# EAGLE design guider-shield (EAGLE 7.6.0)
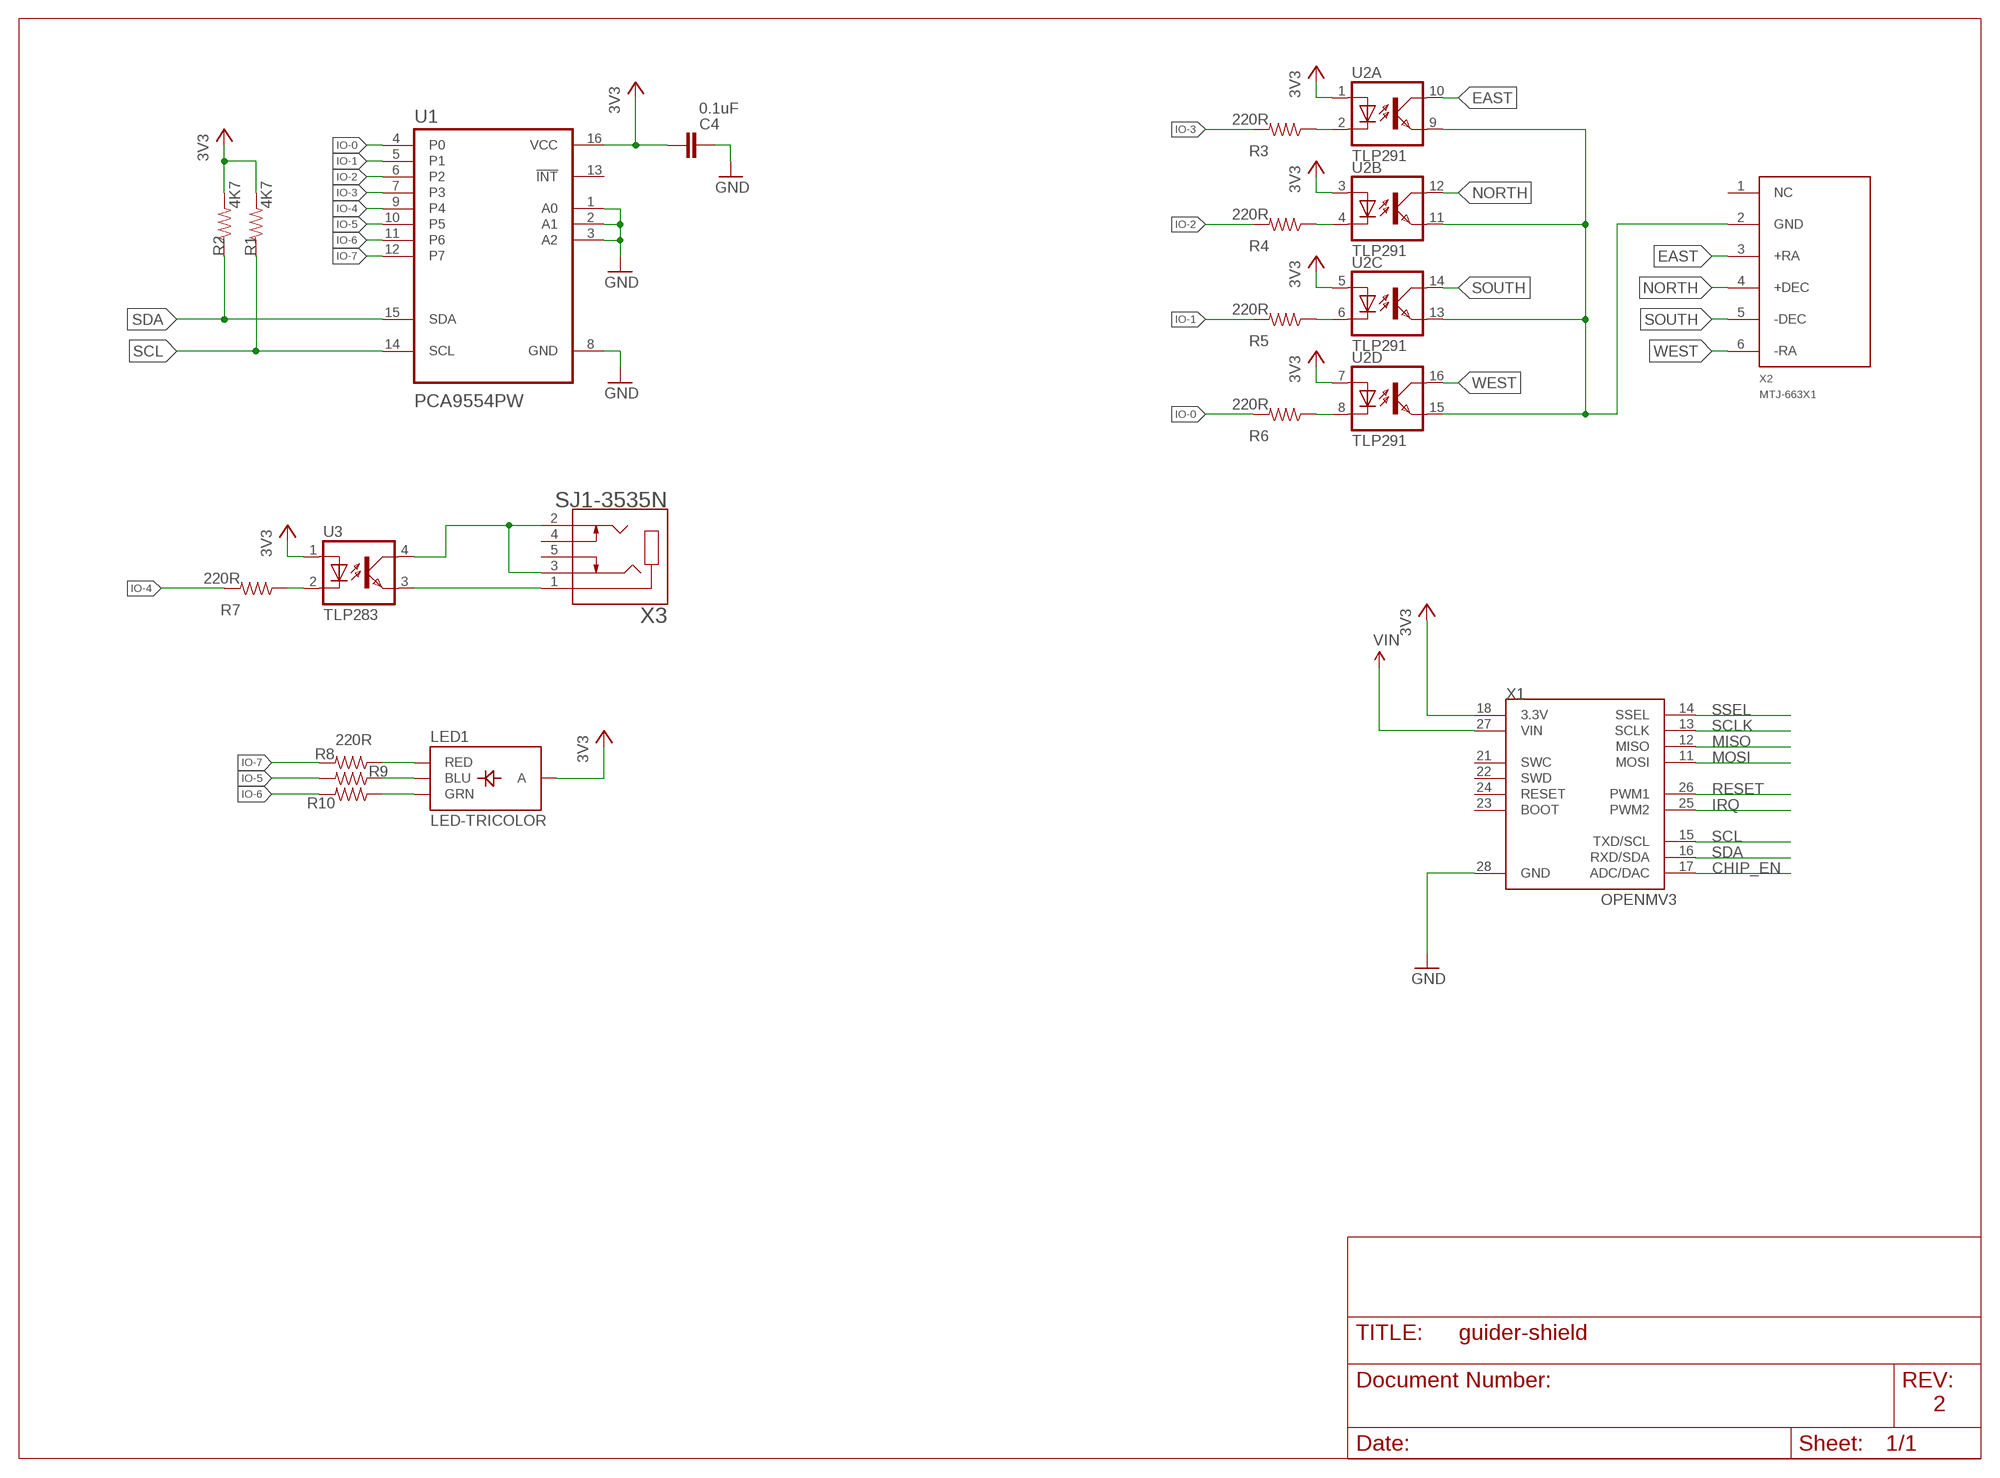
[diagram p0: schematic, sheet 1]

## Parts
C4  0.1uF  CAP0603-CAP  [0603-CAP]
LED1  LED-TRICOLOR  [LED-TRICOLOR-SMD]
R1  4K7  RESISTOR0603-RES  [0603-RES]
R2  4K7  RESISTOR0603-RES  [0603-RES]
R3  220R  RESISTOR0603-RES  [0603-RES]
R4  220R  RESISTOR0603-RES  [0603-RES]
R5  220R  RESISTOR0603-RES  [0603-RES]
R6  220R  RESISTOR0603-RES  [0603-RES]
R7  220R  RESISTOR0603-RES  [0603-RES]
R8  220R  RESISTOR0603-RES  [0603-RES]
R9  220R  RESISTOR0603-RES  [0603-RES]
R10  220R  RESISTOR0603-RES  [0603-RES]
U1  PCA9554PW  [SOP65P640X120-16N]
U2  TLP291  TLP283-4-SO016  [SO016]
U3  TLP283  [MINI-FLAT-4]
X1  OPENMV3  [OPENMV3]
X2  MTJ-663X1  ST-4-MTJ-663X1  [MTJ-663X1]
X3  SJ1-3535N  [CUI_SJ1-3535N]

## Nets
3V3: C4.1 LED1.A R1.2 R2.2 U1.16(VCC) U2.1(A:A) U2.3(B:A) U2.5(C:A) U2.7(D:A) U3.1(A) X1.18(3.3V)
CHIP_EN: X1.17(ADC/DAC)
EAST: U2.10(A:COL) X2.3(+RA)
GND: C4.2 U1.1(A0) U1.2(A1) U1.3(A2) U1.8(GND) X1.28(GND)
IO-0: R6.2 U1.4(P0)
IO-1: R5.2 U1.5(P1)
IO-2: R4.2 U1.6(P2)
IO-3: R3.2 U1.7(P3)
IO-4: R7.2 U1.9(P4)
IO-5: R9.2 U1.10(P5)
IO-6: R10.2 U1.11(P6)
IO-7: R8.2 U1.12(P7)
IRQ: X1.25(PWM2)
MISO: X1.12(MISO)
MOSI: X1.11(MOSI)
N$1: LED1.R(RED) R8.1
N$2: LED1.B(BLU) R9.1
N$4: LED1.G(GRN) R10.1
N$8: R3.1 U2.2(A:C)
N$13: R7.1 U3.2(C)
N$14: U3.3(EMIT) X3.1
N$15: U3.4(COL) X3.2 X3.3
N$16: R4.1 U2.4(B:C)
N$20: R5.1 U2.6(C:C)
N$21: R6.1 U2.8(D:C)
N$24: U2.9(A:EMIT) U2.11(B:EMIT) U2.13(C:EMIT) U2.15(D:EMIT) X2.2(GND)
NORTH: U2.12(B:COL) X2.4(+DEC)
RESET: X1.26(PWM1)
SCL: R1.1 U1.14(SCL) X1.15(TXD/SCL)
SCLK: X1.13(SCLK)
SDA: R2.1 U1.15(SDA) X1.16(RXD/SDA)
SOUTH: U2.14(C:COL) X2.5(-DEC)
SSEL: X1.14(SSEL)
VIN: X1.27(VIN)
WEST: U2.16(D:COL) X2.6(-RA)
Unconnected: U1.13(!INT) X1.21(SWC) X1.22(SWD) X1.23(BOOT) X1.24(RESET) X2.1(NC) X3.4 X3.5

## Notes on the sheet
- 2

## Library data of the parts
C4 = sfe:CAP: Capacitor Standard 0603 ceramic capacitor, and 0.1" leaded capacitor.
LED1 = guider-shield:LED-TRICOLOR: Tri-Color LED SMD Proven layout and schematic for triple color LED in SMD package - common anode. Spark Fun Electronics SKU : COM-07844; MFG-MODEL: CLV1A-FKB-CK1VW1DE1BB7C3C3
R1-R10 = sfe:RESISTOR: Resistor Basic schematic elements and footprints for 0603, 1206, and PTH resistors.
U1 = guider-shield:PCA9554PW; AVAILABILITY: Unavailable; DESCRIPTION: Remote 8-Bit I2C and SMBus I/O Expander with Interrupt Output and Configuration Registers 16-TSSOP -40 to 85; MF: Texas Instruments; MP: PCA9554PW; PACKAGE: TSSOP-16 Texas Instruments; PRICE: None
U2 = guider-shield:TLP283-4: TOSHIBA PHOTOCOUPLER GaAs IRED & PHOTO-TRANSISTOR Source: http://www.semicon.toshiba.co.jp/td/en/Opto/Photocoupler/en_20050928_TLP283_datasheet.pdf
U3 = guider-shield:TLP283: TOSHIBA PHOTOCOUPLER GaAs IRED & PHOTO-TRANSISTOR Source: http://www.semicon.toshiba.co.jp/td/en/Opto/Photocoupler/en_20050928_TLP283_datasheet.pdf; OC_FARNELL: unknown; OC_NEWARK: unknown
X1 = openmv:OPENMV3
X2 = guider-shield:ST-4
X3 = guider-shield:SJ1-3535N: SJ1 Series 3.5 mm 12 V Right Angle Through Hole Isolated Stereo Audio Jack Check prices <https://pricing.snapeda.com/search/part/SJ1-3535N/?ref=eda>; AVAILABILITY: Good; CUI_PURCHASE_URL: https://www.cuidevices.com/product/interconnect/connectors/audio-connectors/jacks/sj1-353xn-series?utm_source=snapeda.com&utm_medium=referral&utm_campaign=snapedaBOM; DESCRIPTION: 3.5 mm, Stereo, Right Angle, Through Hole, Audio Jack Connector; MF: CUI Devices; MP: SJ1-3535N; PACKAGE: None; PRICE: None; PURCHASE-URL: https://pricing.snapeda.com/search/part/SJ1-3535N/?ref=eda

## Net classes
1 vcc: width 1.016 mm, clearance 0.203 mm
2 antenna: width 0.363 mm, clearance 0.305 mm
3 1.8v: width 0.457 mm, clearance 0.254 mm

## Board
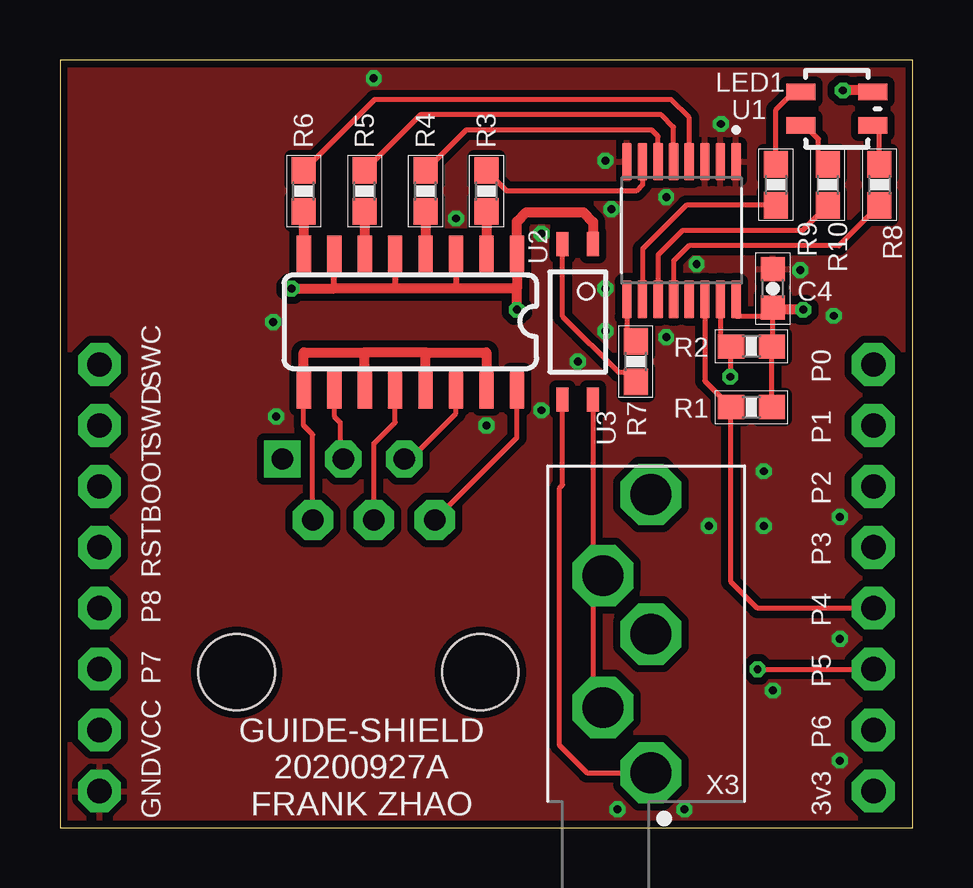
[diagram p1: board, top side]
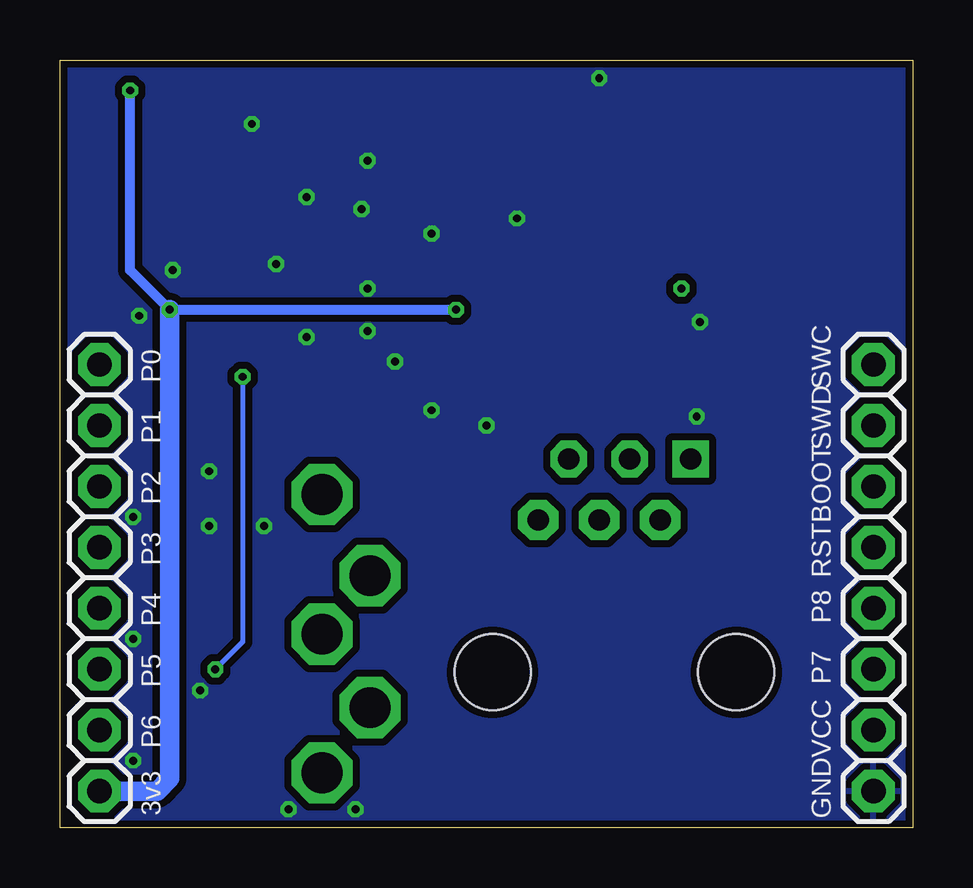
[diagram p2: board, bottom side, seen from below]

Size 35.56 x 32 mm. Coordinates in mm from the lower left corner, seen from the top.
Outline: 0,0 35.56,0 35.56,32 0,32 0,0
Copper layers (1*16): Top 0.035mm / dielectric 1.5mm / Bottom 0.035mm
Design rules "default": minimum track width 8mil, minimum drill 13mil, track to track 6mil, track to pad 6mil, pad to pad 6mil, via to via 6mil, smd to smd 6mil, copper to edge 5mil, drill to drill 10mil, minimum pad ring 10mil, minimum via ring 4mil, stop-mask expansion 2mil, vias tented up to drill 40mil, thermal gap 10mil
tRestrict: 2 lines

### Footprints (pad centres in the part's own frame; a part is rotated, then mirrored left to right if it is on the bottom)
0603-CAP = smd 1 x 1: 1 -0.8,0; 2 0.8,0
LED-TRICOLOR-SMD = smd 0.7 x 1.2: A 0.7,-1.5; B 0.7,1.5; G -0.7,1.5; R -0.7,-1.5
0603-RES = smd 1.1 x 1: 1 -0.85,0; 2 0.85,0
SOP65P640X120-16N = smd 1.57 x 0.41: 1 -2.87,2.275; 2 -2.87,1.625; 3 -2.87,0.975; 4 -2.87,0.325; 5 -2.87,-0.325; 6 -2.87,-0.975; 7 -2.87,-1.625; 8 -2.87,-2.275; 9 2.87,-2.275; 10 2.87,-1.625; 11 2.87,-0.975; 12 2.87,-0.325; 13 2.87,0.325; 14 2.87,0.975; 15 2.87,1.625; 16 2.87,2.275
SO016 = smd 0.6 x 1.6: 1 -4.445,-2.8; 2 -3.175,-2.8; 3 -1.905,-2.8; 4 -0.635,-2.8; 5 0.635,-2.8; 6 1.905,-2.8; 7 3.175,-2.8; 8 4.445,-2.8; 9 4.445,2.8; 10 3.175,2.8; 11 1.905,2.8; 12 0.635,2.8; 13 -0.635,2.8; 14 -1.905,2.8; 15 -3.175,2.8; 16 -4.445,2.8
MINI-FLAT-4 = smd 1 x 0.5: 1 -3.24,0.635; 2 -3.24,-0.635; 3 3.24,-0.635; 4 3.24,0.635
OPENMV3 = drill 1.016 pad 1.778 octagon: 11 1.651,19.304; 12 1.651,16.764; 13 1.651,14.224; 14 1.651,11.684; 15 1.651,9.144; 16 1.651,6.604; 17 1.651,4.064; 18 1.651,1.524; 21 33.909,19.304; 22 33.909,16.764; 23 33.909,14.224; 24 33.909,11.684; 25 33.909,9.144; 26 33.909,6.604; 27 33.909,4.064; 28 33.909,1.524
MTJ-663X1 = drill 0.889 pad 1.524 square: 1 -3.175,8.89 | drill 0.889 pad 1.676 octagon: 2 -1.905,6.35; 4 0.635,6.35; 6 3.175,6.35 | drill 0.889 pad 1.524 octagon: 3 -0.635,8.89; 5 1.905,8.89 | hole 3.175: -5.08,0; 5.08,0
CUI_SJ1-3535N = drill 1.7 octagon: 1 0,0; 2 2.717,2; 3 8.217,2; 4 11.6,0; 5 5.782,0

### Placement (x,y rotation side)
C4  29.72,22.48 90 top
LED1  32.38,29.97 90 top
R1  28.83,17.53 0 top
R2  28.83,20.07 0 top
R3  17.78,26.54 90 top
R4  15.24,26.54 90 top
R5  12.7,26.54 90 top
R6  10.16,26.54 90 top
R7  24,19.43 90 top
R8  34.16,26.8 270 top
R9  29.84,26.8 270 top
R10  32,26.8 270 top
U1  25.91,24.89 270 top
U2  14.61,21.08 180 top
U3  21.59,21.08 270 top
X1  35.56,0 0 bottom
X2  12.45,6.48 0 top
X3  24.64,2.29 90 top

### Tracks (layer width: path | path; a pad name or v marks a point on that pad's centre or on a via)
3V3  (via drill 0.33)
  Top 0.203: U1.16 28.18,21.34 29.72,21.34 | R1.2 R2.2 29.72,20.07 C4.1
  Top 0.254: 11.43,22.48 U2.7 | U2.5 13.97,22.48 | U2.3 16.51,22.48
  Top 0.305: 29.72,21.34 C4.1
  Top 0.406: 19.05,22.48 U2.1 19.05,25.27 19.43,25.65 21.82,25.65 22.23,25.25 U3.1 | 19.05,22.48 16.51,22.48 13.97,22.48 11.43,22.48 v9.65,22.48 | v19.05,21.59 19.05,22.48 | v30.99,21.59 29.72,21.59 C4.1 | LED1.A 33.82,30.73 v32.64,30.73
  Bottom 0.406: v19.05,21.59 v30.99,21.59 32.64,23.24 v32.64,30.73
  Bottom 0.813: X1.18 31.51,1.52 30.99,2.05 v30.99,21.59
EAST
  Top 0.203: U2.10 11.43,17.14 11.68,16.89 11.68,15.49 X2.3
GND  (via drill 0.33)
  other vias: 32.51,12.95 26.04,0.76 8.89,21.08 29.34,14.86 20.07,17.4 22.73,27.81 30.86,23.24 16.51,25.4 23.24,0.76 22.73,20.7 22.73,22.48 20.07,24.77 26.54,23.5 25.27,26.29 27.56,29.34 29.34,12.57 27.05,12.57 32.26,21.34 25.27,20.45 29.72,5.71 32.51,2.79 32.51,7.87 9.02,17.14 17.78,16.76 13.08,31.24 21.59,19.43 22.99,25.78
  pour Top (isolate 0.305, rank 2): 0,0 0,32 35.56,32 35.56,0
  pour Bottom (isolate 0.305, rank 2): 0,0 0,32 35.56,32 35.56,0
IO-0
  Top 0.203: U1.4 26.23,29.59 25.47,30.35 13.12,30.35 R6.2
IO-1
  Top 0.203: U1.5 25.58,29.2 25.07,29.72 15.03,29.72 R5.2
IO-2
  Top 0.203: U1.6 24.93,28.83 24.68,29.08 16.93,29.08 R4.2
IO-3
  Top 0.203: U1.7 24.28,26.8 24.03,26.54 18.63,26.54 R3.2
IO-4
  Top 0.203: U1.9 23.63,20.65 R7.2
IO-5
  Top 0.203: R9.2 26.11,25.95 24.28,24.12 U1.10
IO-6
  Top 0.203: R10.2 30.95,24.89 25.95,24.89 24.93,23.88 U1.11
IO-7
  Top 0.203: R8.2 32.47,24.26 26.22,24.26 25.58,23.62 U1.12
N$1
  Top 0.203: R8.1 34.16,29.27 LED1.R
N$2
  Top 0.203: R9.1 29.84,29.93 30.59,30.67 LED1.B
N$4
  Top 0.203: R10.1 31.62,27.65 31.62,28.7 31.05,29.27 LED1.G
N$8
  Top 0.406: R3.1 U2.2
N$13
  Top 0.203: U3.2 20.95,21.31 23.28,18.99 24,18.99 R7.1
N$14
  Top 0.203: X3.1 21.96,2.29 20.83,3.42 20.83,14.16 20.95,14.29 U3.3
N$15
  Top 0.203: U3.4 22.23,10.5 | X3.2 22.23,5.42 22.23,10.29 22.23,10.5 | X3.3 22.23,10.5
N$16
  Top 0.406: R4.1 U2.4
N$20
  Top 0.406: R5.1 U2.6
N$21
  Top 0.406: R6.1 U2.8
N$24
  Top 0.203: X2.2 10.54,16.38 10.16,16.76 U2.9
  Top 0.406: U2.9 10.16,19.81 12.7,19.81 | 15.24,19.81 17.78,19.81 U2.15 | U2.13 15.24,19.81 | 15.24,19.81 12.7,19.81 | U2.11 12.7,19.81
NORTH
  Top 0.203: 13.97,17.91 U2.12 13.97,16.89 13.08,16 X2.4
SCL
  Top 0.203: U1.14 26.88,18.62 R1.1 27.98,10.25 29.08,9.14 X1.15
SDA  (via drill 0.33)
  Top 0.203: U1.15 27.53,20.07 R2.1 27.94,20.03 v27.94,18.8 | v29.08,6.6 X1.16
  Bottom 0.203: v27.94,18.8 27.94,7.75 v29.08,6.6
SOUTH
  Top 0.203: X2.5 14.61,15.37 16.51,17.27 U2.14
WEST
  Top 0.203: X2.6 19.05,16.26 U2.16

### Text on the board
tPlace: P0 | SWC | SWD | P1 | BOOT | P2 | P3 | RST | P8 | P4 | P7 | P5 | VCC | GUIDE-SHIELD / 20200927A / FRANK ZHAO | P6 | 3v3 | GND
bPlace: P0 | SWC | SWD | P1 | BOOT | P2 | P3 | RST | P8 | P4 | P7 | P5 | VCC | P6 | 3v3 | GND